# Altium project PCU.PrjPCB (part 1 of 2)
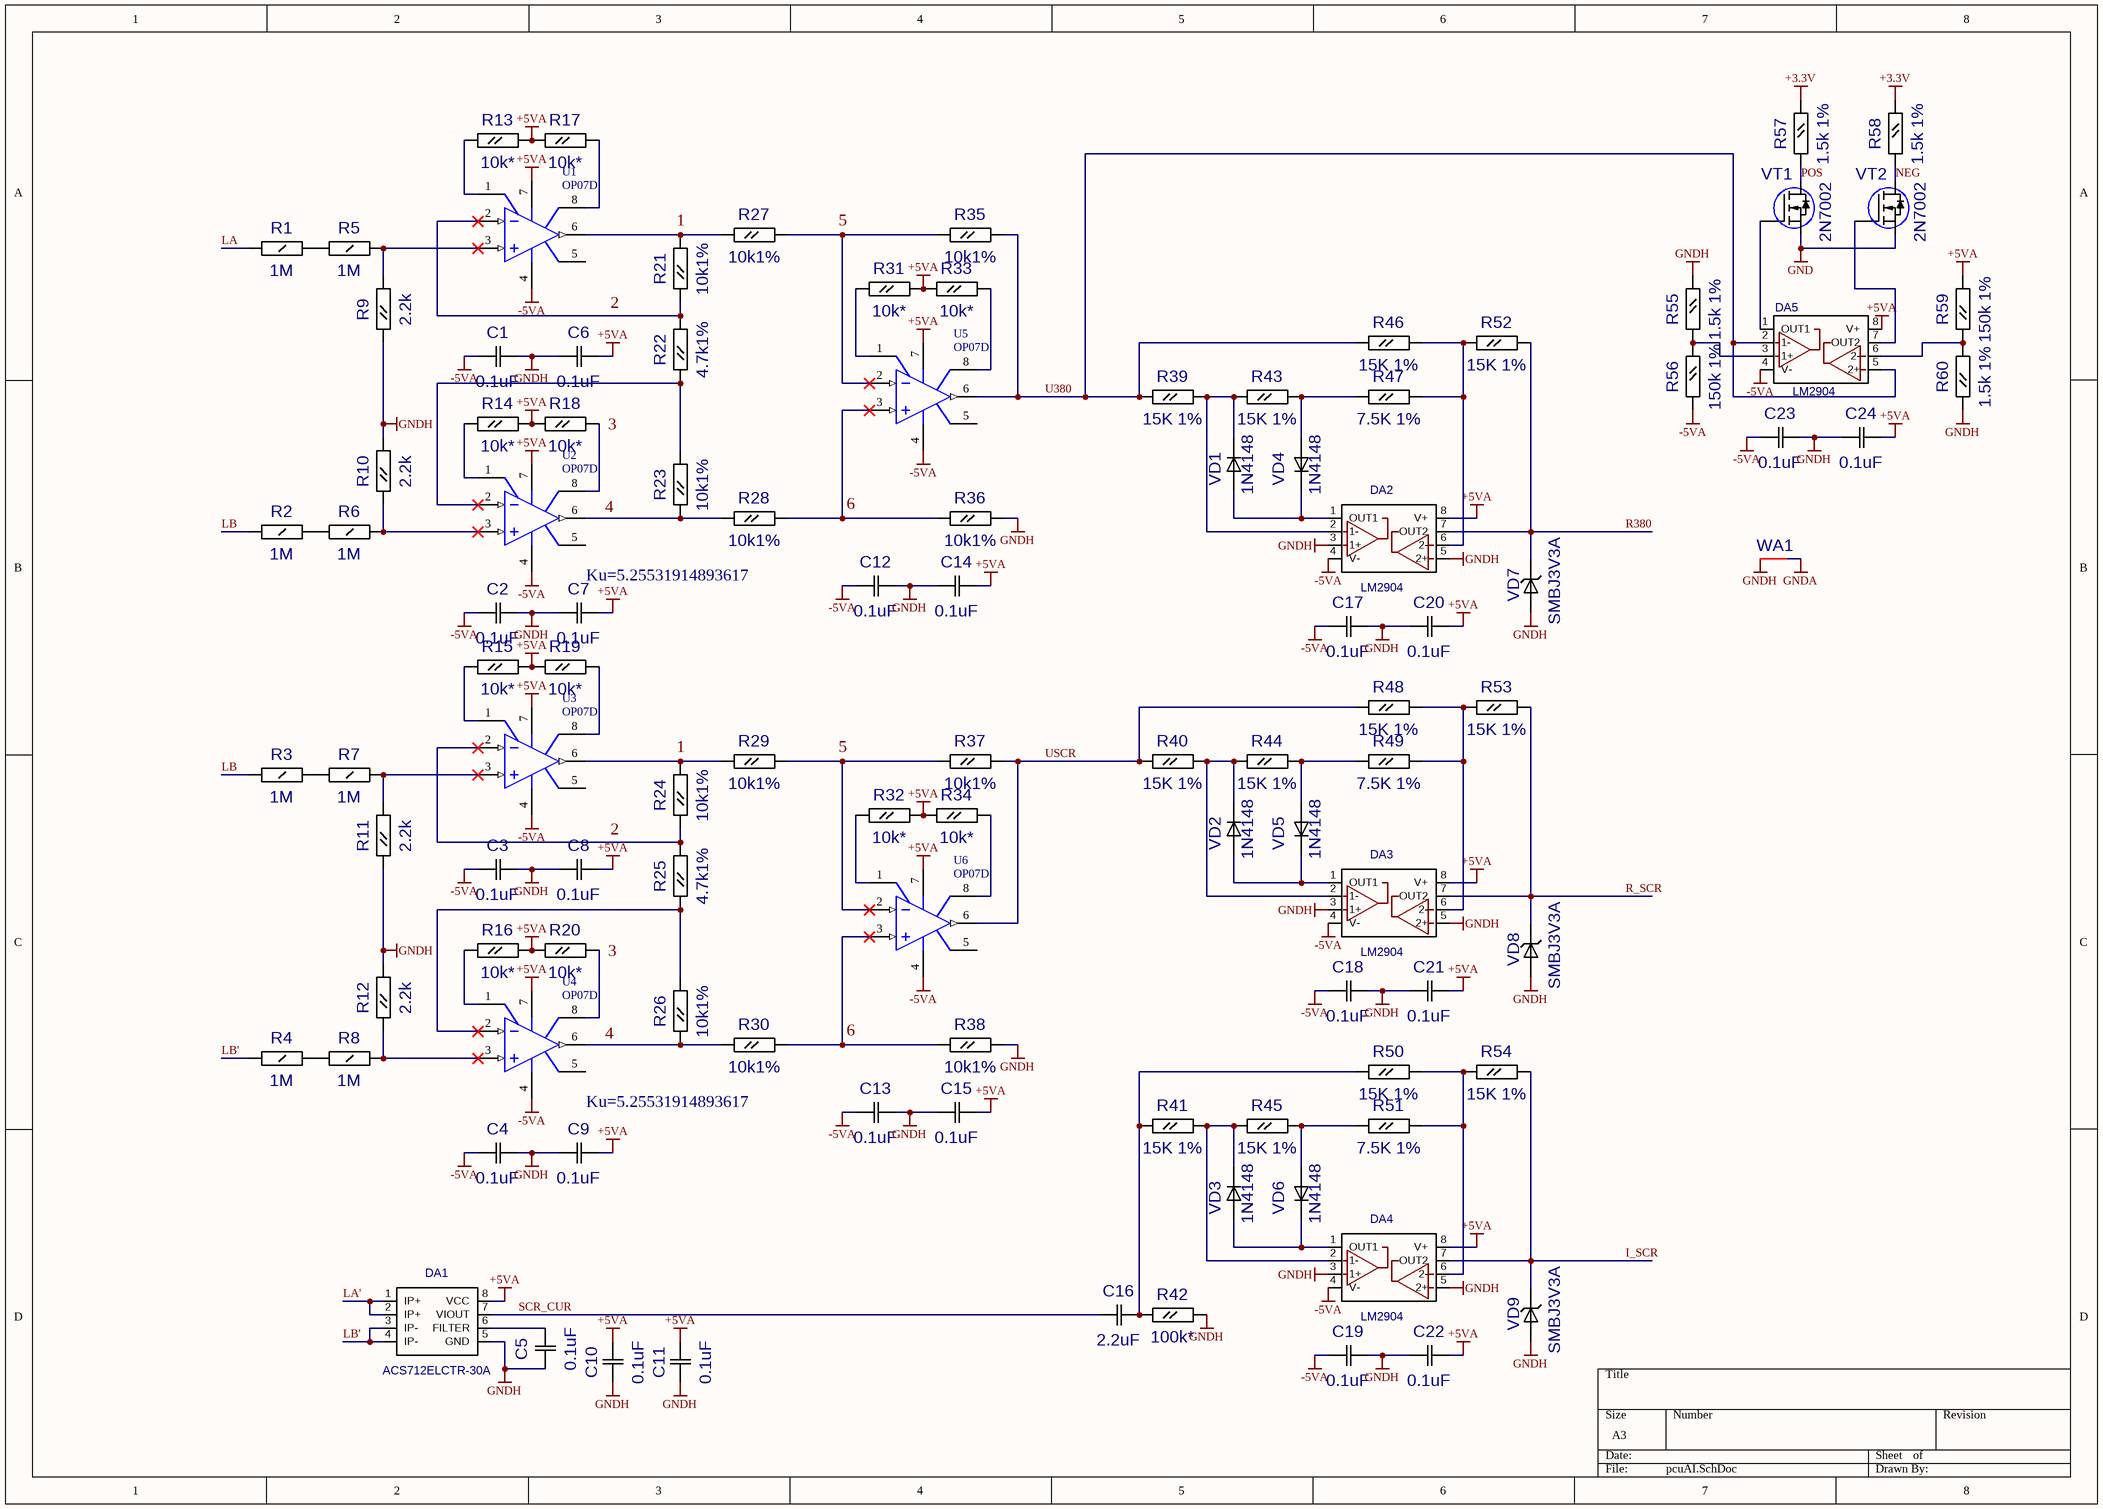
[diagram p0: pcuAI.SchDoc]
7 sheets, 611 parts. Net scope: global (net labels, ports and power ports of the same name join across sheets).
Board file: PCUv1.PcbDoc
Sheets:
  pcuAI.SchDoc
  pcuTC.SchDoc
  pcuCPU.SchDoc
  pcuPWR.SchDoc
  pcuOut.SchDoc
  pcuPL.SchDoc
  pcuETH.SchDoc

## Sheet pcuAI.SchDoc
size A3

### Parts
C1  value 0.1uF  [C0805]  (hidden comment: C0805)
C2  value 0.1uF  [C0805]  (hidden comment: C0805)
C3  value 0.1uF  [C0805]  (hidden comment: C0805)
C4  value 0.1uF  [C0805]  (hidden comment: C0805)
C5  value 0.1uF  [C0805]  (hidden comment: C0805)
C6  value 0.1uF  [C0805]  (hidden comment: C0805)
C7  value 0.1uF  [C0805]  (hidden comment: C0805)
C8  value 0.1uF  [C0805]  (hidden comment: C0805)
C9  value 0.1uF  [C0805]  (hidden comment: C0805)
C10  value 0.1uF  [C0805]  (hidden comment: C0805)
C11  value 0.1uF  [C0805]  (hidden comment: C0805)
C12  value 0.1uF  [C0805]  (hidden comment: C0805)
C13  value 0.1uF  [C0805]  (hidden comment: C0805)
C14  value 0.1uF  [C0805]  (hidden comment: C0805)
C15  value 0.1uF  [C0805]  (hidden comment: C0805)
C16  value 2.2uF  [C0805]  (hidden comment: C0805)
C17  value 0.1uF  [C0805]  (hidden comment: C0805)
C18  value 0.1uF  [C0805]  (hidden comment: C0805)
C19  value 0.1uF  [C0805]  (hidden comment: C0805)
C20  value 0.1uF  [C0805]  (hidden comment: C0805)
C21  value 0.1uF  [C0805]  (hidden comment: C0805)
C22  value 0.1uF  [C0805]  (hidden comment: C0805)
C23  value 0.1uF  [C0805]  (hidden comment: C0805)
C24  value 0.1uF  [C0805]  (hidden comment: C0805)
DA1  ACS712ELCTR-30A  [SO8-1.27]
DA2  LM2904  [SO8-1.27]
DA3  LM2904  [SO8-1.27]
DA4  LM2904  [SO8-1.27]
DA5  LM2904  [SO8-1.27]
R1  value 1M  [R1206]  (hidden comment: R1206)
R2  value 1M  [R1206]  (hidden comment: R1206)
R3  value 1M  [R1206]  (hidden comment: R1206)
R4  value 1M  [R1206]  (hidden comment: R1206)
R5  value 1M  [R1206]  (hidden comment: R1206)
R6  value 1M  [R1206]  (hidden comment: R1206)
R7  value 1M  [R1206]  (hidden comment: R1206)
R8  value 1M  [R1206]  (hidden comment: R1206)
R9  value 2.2k  [R0805]  (hidden comment: R0805)
R10  value 2.2k  [R0805]  (hidden comment: R0805)
R11  value 2.2k  [R0805]  (hidden comment: R0805)
R12  value 2.2k  [R0805]  (hidden comment: R0805)
R13  value 10k*  [R0805]  (hidden comment: R0805)
R14  value 10k*  [R0805]  (hidden comment: R0805)
R15  value 10k*  [R0805]  (hidden comment: R0805)
R16  value 10k*  [R0805]  (hidden comment: R0805)
R17  value 10k*  [R0805]  (hidden comment: R0805)
R18  value 10k*  [R0805]  (hidden comment: R0805)
R19  value 10k*  [R0805]  (hidden comment: R0805)
R20  value 10k*  [R0805]  (hidden comment: R0805)
R21  value 10k1%  [R0805]  (hidden comment: R0805)
R22  value 4.7k1%  [R0805]  (hidden comment: R0805)
R23  value 10k1%  [R0805]  (hidden comment: R0805)
R24  value 10k1%  [R0805]  (hidden comment: R0805)
R25  value 4.7k1%  [R0805]  (hidden comment: R0805)
R26  value 10k1%  [R0805]  (hidden comment: R0805)
R27  value 10k1%  [R0805]  (hidden comment: R0805)
R28  value 10k1%  [R0805]  (hidden comment: R0805)
R29  value 10k1%  [R0805]  (hidden comment: R0805)
R30  value 10k1%  [R0805]  (hidden comment: R0805)
R31  value 10k*  [R0805]  (hidden comment: R0805)
R32  value 10k*  [R0805]  (hidden comment: R0805)
R33  value 10k*  [R0805]  (hidden comment: R0805)
R34  value 10k*  [R0805]  (hidden comment: R0805)
R35  value 10k1%  [R0805]  (hidden comment: R0805)
R36  value 10k1%  [R0805]  (hidden comment: R0805)
R37  value 10k1%  [R0805]  (hidden comment: R0805)
R38  value 10k1%  [R0805]  (hidden comment: R0805)
R39  value 15K 1%  [R0805]  (hidden comment: R0805)
R40  value 15K 1%  [R0805]  (hidden comment: R0805)
R41  value 15K 1%  [R0805]  (hidden comment: R0805)
R42  value 100k*  [R0805]  (hidden comment: R0805)
R43  value 15K 1%  [R0805]  (hidden comment: R0805)
R44  value 15K 1%  [R0805]  (hidden comment: R0805)
R45  value 15K 1%  [R0805]  (hidden comment: R0805)
R46  value 15K 1%  [R0805]  (hidden comment: R0805)
R47  value 7.5K 1%  [R0805]  (hidden comment: R0805)
R48  value 15K 1%  [R0805]  (hidden comment: R0805)
R49  value 7.5K 1%  [R0805]  (hidden comment: R0805)
R50  value 15K 1%  [R0805]  (hidden comment: R0805)
R51  value 7.5K 1%  [R0805]  (hidden comment: R0805)
R52  value 15K 1%  [R0805]  (hidden comment: R0805)
R53  value 15K 1%  [R0805]  (hidden comment: R0805)
R54  value 15K 1%  [R0805]  (hidden comment: R0805)
R55  value 1.5k 1%  [R0805]  (hidden comment: R0805)
R56  value 150k 1%  [R0805]  (hidden comment: R0805)
R57  value 1.5k 1%  [R0805]  (hidden comment: R0805)
R58  value 1.5k 1%  [R0805]  (hidden comment: R0805)
R59  value 150k 1%  [R0805]  (hidden comment: R0805)
R60  value 1.5k 1%  [R0805]  (hidden comment: R0805)
U1  OP07D  [SO8-1.27]
U2  OP07D  [SO8-1.27]
U3  OP07D  [SO8-1.27]
U4  OP07D  [SO8-1.27]
U5  OP07D  [SO8-1.27]
U6  OP07D  [SO8-1.27]
VD1  value 1N4148  [SOD123]  (hidden comment: DIOD_thin)
VD2  value 1N4148  [SOD123]  (hidden comment: DIOD_thin)
VD3  value 1N4148  [SOD123]  (hidden comment: DIOD_thin)
VD4  value 1N4148  [SOD123]  (hidden comment: DIOD_thin)
VD5  value 1N4148  [SOD123]  (hidden comment: DIOD_thin)
VD6  value 1N4148  [SOD123]  (hidden comment: DIOD_thin)
VD7  value SMBJ3V3A  [DO-214AA(SMB)]  (hidden comment: 10BQ100)
VD8  value SMBJ3V3A  [DO-214AA(SMB)]  (hidden comment: 10BQ100)
VD9  value SMBJ3V3A  [DO-214AA(SMB)]  (hidden comment: 10BQ100)
VT1  2N7002  [SOT23-1]
VT2  2N7002  [SOT23-1]
WA1  Net connector  [Net connector]  (value not drawn)  (net tie, no BOM)

### Nets
+3.3V: R57.2 R58.2
+5VA: C6.2 C7.2 C8.2 C9.2 C10.2 C11.2 C14.2 C15.2 C20.2 C21.2 C22.2 C24.2 DA1.8(VCC) DA2.8(V+) DA3.8(V+) DA4.8(V+) DA5.8(V+) R13.1 R14.1 R15.1 R16.1 R17.2 R18.2 R19.2 R20.2 R31.1 R32.1 R33.2 R34.2 R59.1 U1.7(V+) U2.7(V+) U3.7(V+) U4.7(V+) U5.7(V+) U6.7(V+)
-5VA: C1.1 C2.1 C3.1 C4.1 C12.1 C13.1 C17.1 C18.1 C19.1 C23.1 DA2.4(V-) DA3.4(V-) DA4.4(V-) DA5.4(V-) R56.1 U1.4(V-) U2.4(V-) U3.4(V-) U4.4(V-) U5.4(V-) U6.4(V-)
GND: VT1.2(S) VT2.2(S)
GNDA: WA1.1
GNDH: C1.2 C2.2 C3.2 C4.2 C5.1 C6.1 C7.1 C8.1 C9.1 C10.1 C11.1 C12.2 C13.2 C14.1 C15.1 C17.2 C18.2 C19.2 C20.1 C21.1 C22.1 C23.2 C24.1 DA1.5(GND) DA2.3(1+) DA2.5(2+) DA3.3(1+) DA3.5(2+) DA4.3(1+) DA4.5(2+) R9.2 R10.1 R11.2 R12.1 R36.1 R38.1 R42.1 R55.2 R60.2 VD7.2 VD8.2 VD9.2 WA1.2
I_SCR: DA4.7(OUT2) R54.1 VD9.1
LA: R1.2
LA': DA1.1(IP+) DA1.2(IP+)
LB: R2.2 R3.2
LB': DA1.3(IP-) DA1.4(IP-) R4.2
NEG: R58.1 VT2.3(D)
POS: R57.1 VT1.3(D)
R380: DA2.7(OUT2) R52.1 VD7.1
R_SCR: DA3.7(OUT2) R53.1 VD8.1
SCR_CUR: C16.1 DA1.7(VIOUT)
U380: DA5.2(1-) DA5.5(2+) R35.1 R39.2 R46.2 U5.6(OUT)
USCR: R37.1 R40.2 R48.2 U6.6(OUT)
NetC5_2: C5.2 DA1.6(FILTER)
NetC16_2: C16.2 R41.2 R42.2 R50.2
NetDA2_1: DA2.1(OUT1) VD1.2(+) VD4.1(-)
NetDA2_2: DA2.2(1-) R39.1 R43.2 VD1.1(-)
NetDA2_6: DA2.6(2-) R46.1 R47.1 R52.2
NetDA3_1: DA3.1(OUT1) VD2.2(+) VD5.1(-)
NetDA3_2: DA3.2(1-) R40.1 R44.2 VD2.1(-)
NetDA3_6: DA3.6(2-) R48.1 R49.1 R53.2
NetDA4_1: DA4.1(OUT1) VD3.2(+) VD6.1(-)
NetDA4_2: DA4.2(1-) R41.1 R45.2 VD3.1(-)
NetDA4_6: DA4.6(2-) R50.1 R51.1 R54.2
NetDA5_1: DA5.1(OUT1) VT1.1(G)
NetDA5_3: DA5.3(1+) R55.1 R56.2
NetDA5_6: DA5.6(2-) R59.2 R60.1
NetDA5_7: DA5.7(OUT2) VT2.1(G)
NetR1_1: R1.1 R5.2
NetR2_1: R2.1 R6.2
NetR3_1: R3.1 R7.2
NetR4_1: R4.1 R8.2
NetR5_1: R5.1 R9.1 U1.3(IN+)
NetR6_1: R6.1 R10.2 U2.3(IN+)
NetR7_1: R7.1 R11.1 U3.3(IN+)
NetR8_1: R8.1 R12.2 U4.3(IN+)
NetR13_2: R13.2 U1.1(VOSTRIM)
NetR14_2: R14.2 U2.1(VOSTRIM)
NetR15_2: R15.2 U3.1(VOSTRIM)
NetR16_2: R16.2 U4.1(VOSTRIM)
NetR17_1: R17.1 U1.8(VOSTRIM)
NetR18_1: R18.1 U2.8(VOSTRIM)
NetR19_1: R19.1 U3.8(VOSTRIM)
NetR20_1: R20.1 U4.8(VOSTRIM)
NetR21_1: R21.1 R27.2 U1.6(OUT)
NetR21_2: R21.2 R22.1 U1.2(IN-)
NetR22_2: R22.2 R23.1 U2.2(IN-)
NetR23_2: R23.2 R28.2 U2.6(OUT)
NetR24_1: R24.1 R29.2 U3.6(OUT)
NetR24_2: R24.2 R25.1 U3.2(IN-)
NetR25_2: R25.2 R26.1 U4.2(IN-)
NetR26_2: R26.2 R30.2 U4.6(OUT)
NetR27_1: R27.1 R35.2 U5.2(IN-)
NetR28_1: R28.1 R36.2 U5.3(IN+)
NetR29_1: R29.1 R37.2 U6.2(IN-)
NetR30_1: R30.1 R38.2 U6.3(IN+)
NetR31_2: R31.2 U5.1(VOSTRIM)
NetR32_2: R32.2 U6.1(VOSTRIM)
NetR33_1: R33.1 U5.8(VOSTRIM)
NetR34_1: R34.1 U6.8(VOSTRIM)
NetR43_1: R43.1 R47.2 VD4.2(+)
NetR44_1: R44.1 R49.2 VD5.2(+)
NetR45_1: R45.1 R51.2 VD6.2(+)

Not connected (* = marked no-connect by the designer): U1 5(NC); U2 5(NC); U3 5(NC); U4 5(NC); U5 5(NC); U6 5(NC)

### Notes on the sheet
- (near R21) 1
- 5
- 2
- (near R18) 3
- 4
- 6
- Ku=5.25531914893617
- (near R24) 1
- (near R20) 3

### Library data of the parts
C1-C24 = C0805: RefDes2: {RefDes2}
DA1 = ACS713: Value: *
DA2-DA5 = LM2904: LM2903; Value: *
R1-R8 = R1206: RefDes2: {RefDes2}
R9-R60 = R0805: RefDes2: {RefDes2}
U1-U6 = OP07D: Ultra-Low Offset Voltage Operational Amplifier; Note: Pin 5 is not connected.; Published: 8-Jun-2000; LatestRevisionDate: 04-Mar-2005; LatestRevisionNote: Stylized 3D Model Added.; DatasheetVersion: 1992; PackageReference: N-8_A; Publisher: Altium Limited; PackageDescription: DIP; 8 Leads; Row Spacing 7.62 mm; Pitch 2.54 mm; Code_JEDEC: MO-001-AN; ComponentLink1Description: Manufacturer Link; ComponentLink1URL: http://www.analog.com/en/prod/0,,759_786_OP07%2C00.html; ComponentLink2Description: Datasheet; ComponentLink2URL: http://www.analog.com/UploadedFiles/Data_Sheets/39161232478959OP07_c.pdf
VD1-VD6 = DIOD_thin: DIOD 1N4148; RefDes2: {RefDes2}
VD7-VD9 = 10BQ100: RefDes2: {RefDes2}

## Sheet pcuTC.SchDoc
size A3
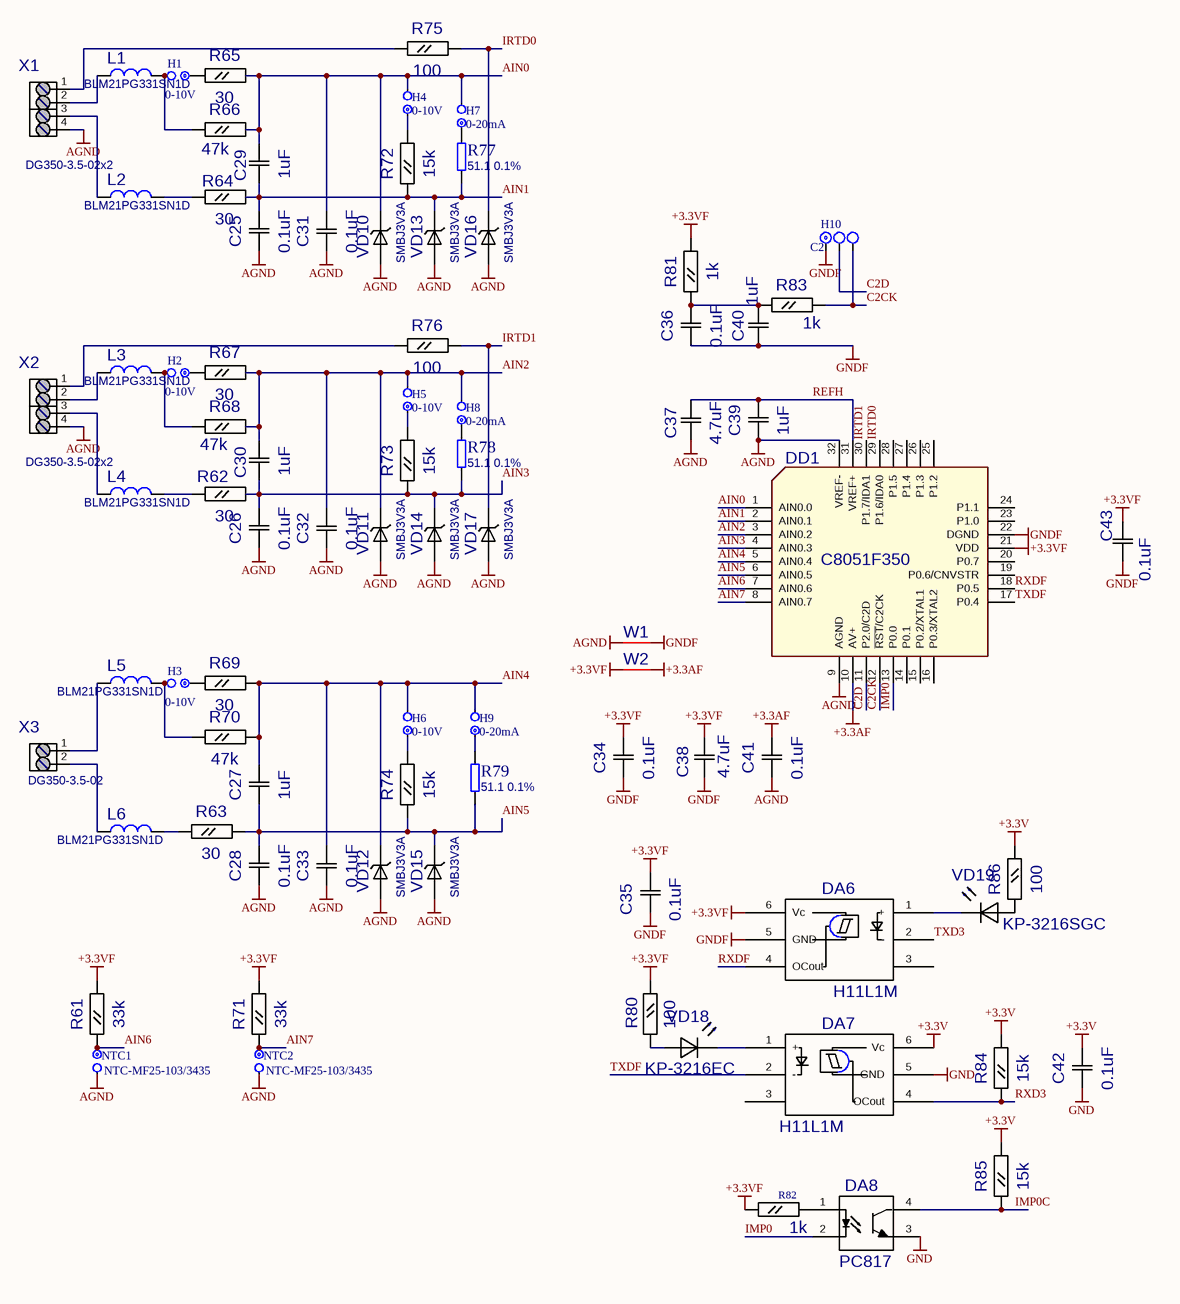
[diagram p1: pcuTC.SchDoc]

### Parts
C25  value 0.1uF  [C0805]  (hidden comment: C0805)
C26  value 0.1uF  [C0805]  (hidden comment: C0805)
C27  value 1uF  [C0805]  (hidden comment: C0805)
C28  value 0.1uF  [C0805]  (hidden comment: C0805)
C29  value 1uF  [C0805]  (hidden comment: C0805)
C30  value 1uF  [C0805]  (hidden comment: C0805)
C31  value 0.1uF  [C0805]  (hidden comment: C0805)
C32  value 0.1uF  [C0805]  (hidden comment: C0805)
C33  value 0.1uF  [C0805]  (hidden comment: C0805)
C34  value 0.1uF  [C0805]  (hidden comment: C0805)
C35  value 0.1uF  [C0805]  (hidden comment: C0805)
C36  value 0.1uF  [C0805]  (hidden comment: C0805)
C37  value 4.7uF  [C0805]  (hidden comment: C0805)
C38  value 4.7uF  [C0805]  (hidden comment: C0805)
C39  value 1uF  [C0805]  (hidden comment: C0805)
C40  value 1uF  [C0805]  (hidden comment: C0805)
C41  value 0.1uF  [C0805]  (hidden comment: C0805)
C42  value 0.1uF  [C0805]  (hidden comment: C0805)
C43  value 0.1uF  [C0805]  (hidden comment: C0805)
DA6  H11L1M  [DIP6_SURFACE]
DA7  H11L1M  [DIP6_SURFACE]
DA8  PC817  [DIL4SMD]
DD1  C8051F350  [LQFP-32_N]
H1  (no value)  [J1x2]
H2  (no value)  [J1x2]
H3  (no value)  [J1x2]
H4  (no value)  [J1x2]
H5  (no value)  [J1x2]
H6  (no value)  [J1x2]
H7  (no value)  [J1x2]
H8  (no value)  [J1x2]
H9  (no value)  [J1x2]
H10  C2  [J1x3]
L1  BLM21PG331SN1D  [R0805]
L2  BLM21PG331SN1D  [R0805]
L3  BLM21PG331SN1D  [R0805]
L4  BLM21PG331SN1D  [R0805]
L5  BLM21PG331SN1D  [R0805]
L6  BLM21PG331SN1D  [R0805]
NTC1  (no value)  [J1x2]
NTC2  (no value)  [J1x2]
R61  value 33k  [R0805]  (hidden comment: R0805)
R62  value 30  [R0805]  (hidden comment: R0805)
R63  value 30  [R0805]  (hidden comment: R0805)
R64  value 30  [R0805]  (hidden comment: R0805)
R65  value 30  [R0805]  (hidden comment: R0805)
R66  value 47k  [R0805]  (hidden comment: R0805)
R67  value 30  [R0805]  (hidden comment: R0805)
R68  value 47k  [R0805]  (hidden comment: R0805)
R69  value 30  [R0805]  (hidden comment: R0805)
R70  value 47k  [R0805]  (hidden comment: R0805)
R71  value 33k  [R0805]  (hidden comment: R0805)
R72  value 15k  [R0805]  (hidden comment: R0805)
R73  value 15k  [R0805]  (hidden comment: R0805)
R74  value 15k  [R0805]  (hidden comment: R0805)
R75  value 100  [R0805]  (hidden comment: R0805)
R76  value 100  [R0805]  (hidden comment: R0805)
R77  51.1 0.1%  [R0.25-300]
R78  51.1 0.1%  [R0.25-300]
R79  51.1 0.1%  [R0.25-300]
R80  value 100  [R0805]  (hidden comment: R0805)
R81  value 1k  [R0805]  (hidden comment: R0805)
R82  value 1k  [R0805]  (hidden comment: R0805)
R83  value 1k  [R0805]  (hidden comment: R0805)
R84  value 15k  [R0805]  (hidden comment: R0805)
R85  value 15k  [R0805]  (hidden comment: R0805)
R86  value 100  [R0805]  (hidden comment: R0805)
VD10  value SMBJ3V3A  [DO-214AA(SMB)]  (hidden comment: 10BQ100)
VD11  value SMBJ3V3A  [DO-214AA(SMB)]  (hidden comment: 10BQ100)
VD12  value SMBJ3V3A  [DO-214AA(SMB)]  (hidden comment: 10BQ100)
VD13  value SMBJ3V3A  [DO-214AA(SMB)]  (hidden comment: 10BQ100)
VD14  value SMBJ3V3A  [DO-214AA(SMB)]  (hidden comment: 10BQ100)
VD15  value SMBJ3V3A  [DO-214AA(SMB)]  (hidden comment: 10BQ100)
VD16  value SMBJ3V3A  [DO-214AA(SMB)]  (hidden comment: 10BQ100)
VD17  value SMBJ3V3A  [DO-214AA(SMB)]  (hidden comment: 10BQ100)
VD18  KP-3216EC  [KP-3216]
VD19  KP-3216SGC  [KP-3216]
W1  Net connector  [Net connector0.5mm]  (value not drawn)  (net tie, no BOM)
W2  Net connector  [Net connector0.5mm]  (value not drawn)  (net tie, no BOM)
X1  DG350-3.5-02x2  [DG350-3.5-04 SLIM - duplicate]
X2  DG350-3.5-02x2  [DG350-3.5-04 SLIM - duplicate]
X3  DG350-3.5-02  [DG350-3.5-02 SLIM]

### Nets
+3.3AF: C41.2 DD1.10(AV+) W2.1
+3.3V: C42.2 DA7.6(Vc) R84.1 R85.1 R86.2
+3.3VF: C34.2 C35.1 C38.2 C43.2 DA6.6(Vc) DD1.21(VDD) R61.1 R71.1 R80.2 R81.1 R82.2 W2.2
AGND: C25.1 C26.1 C28.1 C31.2 C32.2 C33.2 C37.2 C39.1 C41.1 DD1.9(AGND) DD1.32(VREF-) NTC1.2 NTC2.2 VD10.2 VD11.2 VD12.2 VD13.2 VD14.2 VD15.2 VD16.2 VD17.2 W1.2 X1.4 X2.4
GND: C42.1 DA7.5(GND) DA8.3(E)
GNDF: C34.1 C35.2 C36.1 C38.1 C40.1 C43.1 DA6.5(GND) DD1.22(DGND) H10.1 W1.1
AIN0: C29.2 C31.1 DD1.1(AIN0.0) H4.2 H7.2 R65.1 R66.1 VD10.1
AIN1: C25.2 C29.1 DD1.2(AIN0.1) R64.1 R72.2 R77.1 VD13.1
AIN2: C30.2 C32.1 DD1.3(AIN0.2) H5.2 H8.2 R67.1 R68.1 VD11.1
AIN3: C26.2 C30.1 DD1.4(AIN0.3) R62.1 R73.2 R78.1 VD14.1
AIN4: C27.2 C33.1 DD1.5(AIN0.4) H6.2 H9.2 R69.1 R70.1 VD12.1
AIN5: C27.1 C28.2 DD1.6(AIN0.5) R63.1 R74.2 R79.1 VD15.1
AIN6: DD1.7(AIN0.6) NTC1.1 R61.2
AIN7: DD1.8(AIN0.7) NTC2.1 R71.2
C2CK: DD1.12(~{RST}/C2CK) H10.3 R83.1
C2D: DD1.11(P2.0/C2D) H10.2
IMP0: DA8.2(-) DD1.13(P0.0)
IMP0C: DA8.4(C) R85.2
IRTD0: DD1.29(P1.6/IDA0) R75.1 VD16.1
IRTD1: DD1.30(P1.7/IDA1) R76.1 VD17.1
REFH: C37.1 C39.2 DD1.31(VREF+)
RXD3: DA7.4(OCout) R84.2
RXDF: DA6.4(OCout) DD1.18(P0.5)
TXD3: DA6.2(-)
TXDF: DA7.2(-) DD1.17(P0.4)
NetC36_2: C36.2 C40.2 R81.2 R83.2
NetDA6_1: DA6.1(+) VD19.2
NetDA7_1: DA7.1(+) VD18.2
NetDA8_1: DA8.1(+) R82.1
NetH1_1: H1.1 R65.2
NetH1_2: H1.2 L1.2 R66.2
NetH2_1: H2.1 R67.2
NetH2_2: H2.2 L3.2 R68.2
NetH3_1: H3.1 R69.2
NetH3_2: H3.2 L5.2 R70.2
NetH4_1: H4.1 R72.1
NetH5_1: H5.1 R73.1
NetH6_1: H6.1 R74.1
NetH7_1: H7.1 R77.2
NetH8_1: H8.1 R78.2
NetH9_1: H9.1 R79.2
NetL1_1: L1.1 X1.2
NetL2_1: L2.1 X1.3
NetL2_2: L2.2 R64.2
NetL3_1: L3.1 X2.2
NetL4_1: L4.1 X2.3
NetL4_2: L4.2 R62.2
NetL5_1: L5.1 X3.1
NetL6_1: L6.1 X3.2
NetL6_2: L6.2 R63.2
NetR75_2: R75.2 X1.1
NetR76_2: R76.2 X2.1
NetR80_1: R80.1 VD18.1
NetR86_1: R86.1 VD19.1

Not connected (* = marked no-connect by the designer): DA6 3; DA7 3; DD1 14(P0.1) 15(P0.2/XTAL1) 16(P0.3/XTAL2) 19(P0.6/CNVSTR) 20(P0.7) 23(P1.0) 24(P1.1) 25(P1.2) 26(P1.3) 27(P1.4) 28(P1.5)

### Notes on the sheet
- (in symbol H-1x2) 0-20mA; NTC-MF25-103/3435; 0-10V

### Library data of the parts
C25-C43 = C0805: RefDes2: {RefDes2}
DA6 DA7 = H11L1M: RefDes2: {RefDes2}
DA8 = PC817: optocuple; Value: PC817
DD1 = C8051F350: RefDes2: {RefDes2}; Value: {Value}
H1-H9 NTC1 NTC2 = H-1x2
H10 = H-1x3
L1-L6 = BLM21PG331SN1D: Ferrite beads; Value: BLM21PG331SN1D
R61-R76 R80-R86 = R0805: RefDes2: {RefDes2}
R77-R79 = R-0.25W: 0.25W 5% 250V; Price: 0.01; Value: 51.1 0.1%
VD10-VD17 = 10BQ100: RefDes2: {RefDes2}
VD18 = KP-3216EC: RefDes2: {RefDes2}
VD19 = KP-3216SGC: RefDes2: {RefDes2}
X1 X2 = DG350-3.5-04: RefDes2: {RefDes2}
X3 = DG350-3.5-02: RefDes2: {RefDes2}

## Sheet pcuCPU.SchDoc
size A3
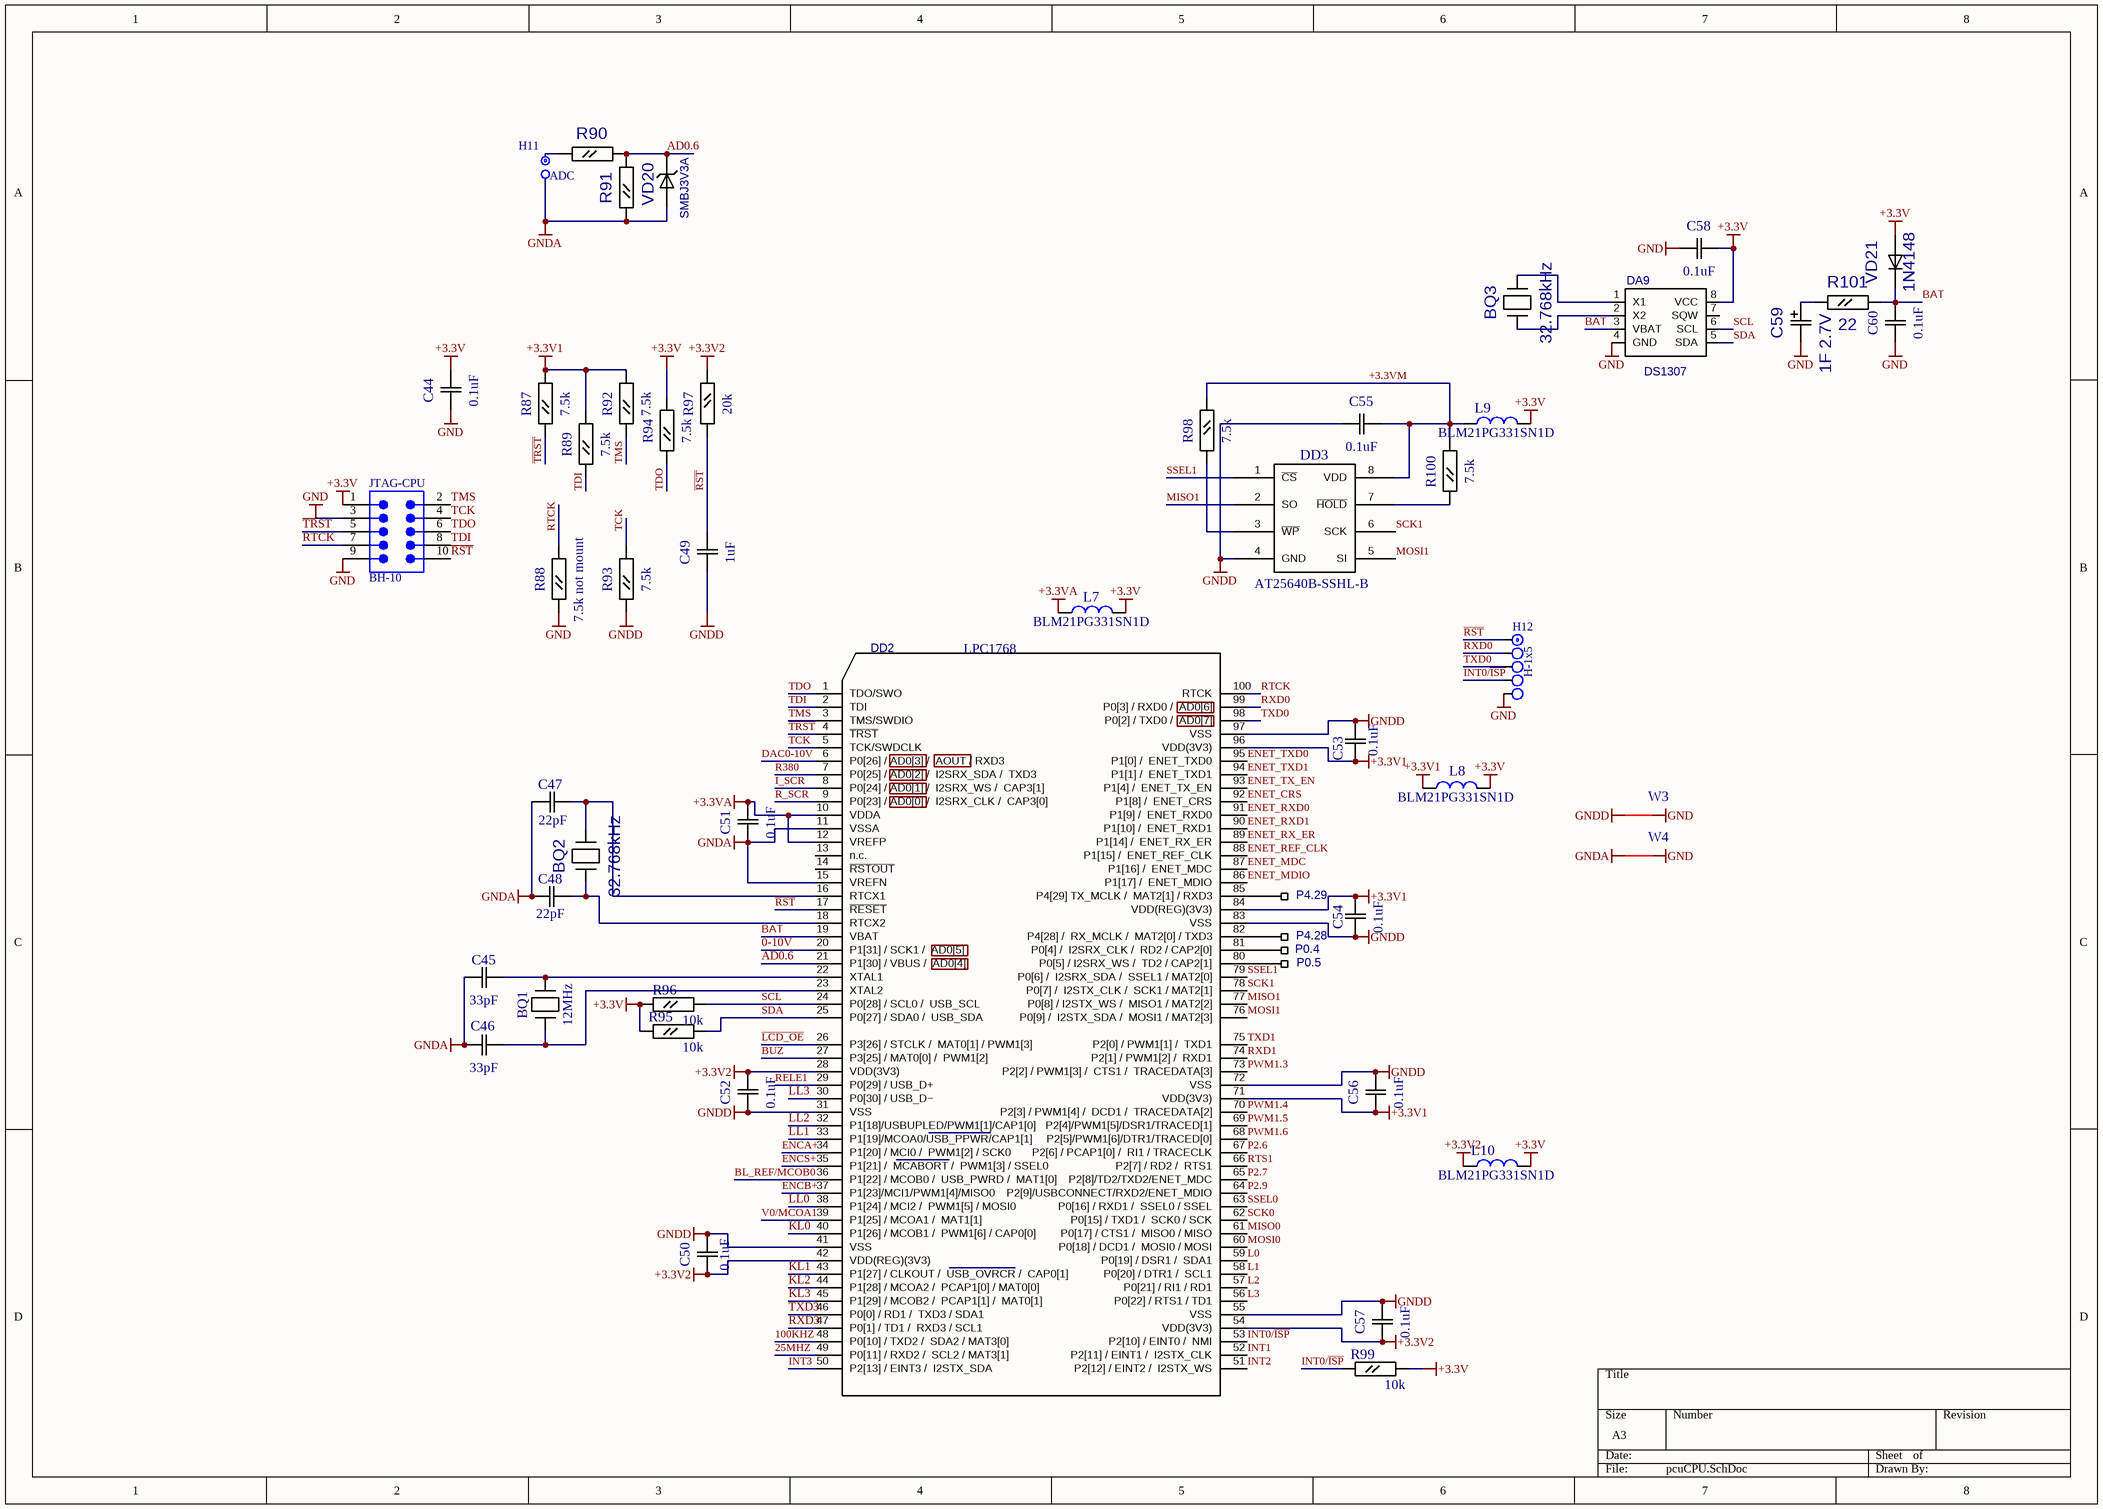
[diagram p2: pcuCPU.SchDoc]

### Parts
BQ1  value 12MHz  [HC49U]  (hidden comment: HC49_VH)
BQ2  value 32.768kHz  [R26]  (hidden comment: R26)
BQ3  value 32.768kHz  [R26smd]  (hidden comment: R26)
C44  value 0.1uF  [C0805]  (hidden comment: C0805)
C45  value 33pF  [C0805]  (hidden comment: C0805)
C46  value 33pF  [C0805]  (hidden comment: C0805)
C47  value 22pF  [C0805]  (hidden comment: C0805)
C48  value 22pF  [C0805]  (hidden comment: C0805)
C49  value 1uF  [C0805]  (hidden comment: C0805)
C50  value 0.1uF  [C0805]  (hidden comment: C0805)
C51  value 0.1uF  [C0805]  (hidden comment: C0805)
C52  value 0.1uF  [C0805]  (hidden comment: C0805)
C53  value 0.1uF  [C0805]  (hidden comment: C0805)
C54  value 0.1uF  [C0805]  (hidden comment: C0805)
C55  value 0.1uF  [C0805]  (hidden comment: C0805)
C56  value 0.1uF  [C0805]  (hidden comment: C0805)
C57  value 0.1uF  [C0805]  (hidden comment: C0805)
C58  value 0.1uF  [C0805]  (hidden comment: C0805)
C59  value 1F 2.7V  [El-d8-h12-F3.81]  (hidden comment: Cap El)
C60  value 0.1uF  [C0805]  (hidden comment: C0805)
DA9  DS1307  [SO8-1.27]
DD2  LPC1768  [QFP100-0.5MM]
DD3  value AT25640B-SSHL-B  [SO8-150]  (hidden comment: FM25L16-G)
H11  ADC  [J1x2]
H12  H-1x5  [J1x5]
JTAG-CPU  BH-10  [J2x5]
L7  BLM21PG331SN1D  [R0805]
L8  BLM21PG331SN1D  [R0805]
L9  BLM21PG331SN1D  [R0805]
L10  BLM21PG331SN1D  [R0805]
P0.4  PCB_1R  [PCB_1R_Oval]  (value not drawn)
P0.5  PCB_1R  [PCB_1R_Oval]  (value not drawn)
P4.28  PCB_1R  [PCB_1R_Oval]  (value not drawn)
P4.29  PCB_1R  [PCB_1R_Oval]  (value not drawn)
R87  value 7.5k  [R0805]  (hidden comment: R0805)
R88  value 7.5k not mount  [R0805]  (hidden comment: R0805)
R89  value 7.5k  [R0805]  (hidden comment: R0805)
R90  R0805  [R0805]  (value not drawn)
R91  R0805  [R0805]  (value not drawn)
R92  value 7.5k  [R0805]  (hidden comment: R0805)
R93  value 7.5k  [R0805]  (hidden comment: R0805)
R94  value 7.5k  [R0805]  (hidden comment: R0805)
R95  value 10k  [R0805]  (hidden comment: R0805)
R96  value 10k  [R0805]  (hidden comment: R0805)
R97  value 20k  [R0805]  (hidden comment: R0805)
R98  value 7.5k  [R0805]  (hidden comment: R0805)
R99  value 10k  [R0805]  (hidden comment: R0805)
R100  value 7.5k  [R0805]  (hidden comment: R0805)
R101  value 22  [R0805]  (hidden comment: R0805)
VD20  value SMBJ3V3A  [DO-214AA(SMB)]  (hidden comment: 10BQ100)
VD21  value 1N4148  [SOD123]  (hidden comment: DIOD_thin)
W3  Net connector  [Net connector]  (value not drawn)  (net tie, no BOM)
W4  Net connector  [Net connector0.5mm]  (value not drawn)  (net tie, no BOM)

### Nets
+3.3V: C44.2 C58.1 DA9.8(VCC) JTAG-CPU.1 L7.2 L8.2 L9.2 L10.2 R94.1 R95.2 R96.2 R99.1 VD21.2(+)
+3.3V1: C53.2 C54.2 C56.2 DD2.71(VDD(3V3)) DD2.84(VDD(REG)(3V3)) DD2.96(VDD(3V3)) L8.1 R87.1 R89.1 R92.1
+3.3V2: C50.2 C52.2 C57.2 DD2.28(VDD(3V3)) DD2.42(VDD(REG)(3V3)) DD2.54(VDD(3V3)) L10.1 R97.2
+3.3VA: C51.2 DD2.10(VDDA) DD2.12(VREFP) L7.1
GND: C44.1 C58.2 C59.2 C60.2 DA9.4(GND) H12.5 JTAG-CPU.3 JTAG-CPU.9 R88.2 W3.1 W4.1
GNDA: C45.2 C46.2 C47.1 C48.2 C51.1 DD2.11(VSSA) DD2.15(VREFN) H11.2 R91.2 VD20.2 W4.2
GNDD: C49.1 C50.1 C52.1 C53.1 C54.1 C55.2 C56.1 C57.1 DD2.31(VSS) DD2.41(VSS) DD2.55(VSS) DD2.72(VSS) DD2.83(VSS) DD2.97(VSS) DD3.4(GND) R93.2 W3.2
0-10V: DD2.20(P1[31]_/_SCK1_/__AD0[5])
25MHZ: DD2.49(P0[11]_/_RXD2_/__SCL2_/_MAT3[1])
100KHZ: DD2.48(P0[10]_/_TXD2_/__SDA2_/_MAT3[0])
+3.3VM: C55.1 DD3.8(VDD) L9.1 R98.2 R100.1
~{LCD_OE}: DD2.26(P3[26]_/_STCLK_/__MAT0[1]_/_PWM1[3])
~{TRST}: DD2.4(~{TRST}) JTAG-CPU.5 R87.2
AD0.6: DD2.21(P1[30]_/_VBUS_/__AD0[4]) R90.1 R91.1 VD20.1
BAT: C60.1 DA9.3(VBAT) DD2.19(VBAT) R101.1 VD21.1(-)
BL_REF/MCOB0: DD2.36(P1[22]_/_MCOB0_/__USB_PWRD_/__MAT1[0])
BUZ: DD2.27(P3[25]_/_MAT0[0]_/__PWM1[2])
DAC0-10V: DD2.6(P0[26]_/_AD0[3]_/__AOUT_/_RXD3)
ENCA+: DD2.34(P1[20]_/_MCI0_/__PWM1[2]_/_SCK0)
ENCB+: DD2.37(P1[23]/MCI1/PWM1[4]/MISO0)
ENCS+: DD2.35(P1[21]_/__MCABORT_/__PWM1[3]_/_SSEL0)
ENET_CRS: DD2.92(P1[8]_/__ENET_CRS)
ENET_MDC: DD2.87(P1[16]_/__ENET_MDC)
ENET_MDIO: DD2.86(P1[17]_/__ENET_MDIO)
ENET_REF_CLK: DD2.88(P1[15]_/__ENET_REF_CLK)
ENET_RX_ER: DD2.89(P1[14]_/__ENET_RX_ER)
ENET_RXD0: DD2.91(P1[9]_/__ENET_RXD0)
ENET_RXD1: DD2.90(P1[10]_/__ENET_RXD1)
ENET_TX_EN: DD2.93(P1[4]_/__ENET_TX_EN)
ENET_TXD0: DD2.95(P1[0]_/__ENET_TXD0)
ENET_TXD1: DD2.94(P1[1]_/__ENET_TXD1)
I_SCR: DD2.8(P0[24]_/_AD0[1]_/__I2SRX_WS_/__CAP3[1])
INT0/~{ISP}: DD2.53(P2[10]_/_EINT0_/__NMI) H12.4 R99.2
INT1: DD2.52(P2[11]_/_EINT1_/__I2STX_CLK)
INT2: DD2.51(P2[12]_/_EINT2_/__I2STX_WS)
INT3: DD2.50(P2[13]_/_EINT3_/__I2STX_SDA)
KL0: DD2.40(P1[26]_/_MCOB1_/__PWM1[6]_/_CAP0[0])
KL1: DD2.43(P1[27]_/_CLKOUT_/__USB_OVRCR_/__CAP0[1])
KL2: DD2.44(P1[28]_/_MCOA2_/__PCAP1[0]_/_MAT0[0])
KL3: DD2.45(P1[29]_/_MCOB2_/__PCAP1[1]_/__MAT0[1])
L0: DD2.59(P0[19]_/_DSR1_/__SDA1)
L1: DD2.58(P0[20]_/_DTR1_/__SCL1)
L2: DD2.57(P0[21]_/_RI1_/_RD1)
L3: DD2.56(P0[22]_/_RTS1_/_TD1)
LL0: DD2.38(P1[24]_/_MCI2_/__PWM1[5]_/_MOSI0)
LL1: DD2.33(P1[19]/MCOA0/USB_PPWR/CAP1[1])
LL2: DD2.32(P1[18]/USBUPLED/PWM1[1]/CAP1[0])
LL3: DD2.30(P0[30]_/_USB_D−)
MISO0: DD2.61(P0[17]_/_CTS1_/__MISO0_/_MISO)
MISO1: DD2.77(P0[8]_/_I2STX_WS_/__MISO1_/_MAT2[2]) DD3.2(SO)
MOSI0: DD2.60(P0[18]_/_DCD1_/__MOSI0_/_MOSI)
MOSI1: DD2.76(P0[9]_/__I2STX_SDA_/__MOSI1_/_MAT2[3]) DD3.5(SI)
P2.6: DD2.67(P2[6]_/_PCAP1[0]_/__RI1_/_TRACECLK)
P2.7: DD2.65(P2[8]/TD2/TXD2/ENET_MDC)
P2.9: DD2.64(P2[9]/USBCONNECT/RXD2/ENET_MDIO)
PWM1.3: DD2.73(P2[2]_/_PWM1[3]_/__CTS1_/__TRACEDATA[3])
PWM1.4: DD2.70(P2[3]_/_PWM1[4]_/__DCD1_/__TRACEDATA[2])
PWM1.5: DD2.69(P2[4]/PWM1[5]/DSR1/TRACED[1])
PWM1.6: DD2.68(P2[5]/PWM1[6]/DTR1/TRACED[0])
R380: DD2.7(P0[25]_/_AD0[2]_/__I2SRX_SDA_/__TXD3)
~{RST}: C49.2 DD2.17(~{RESET}) H12.1 JTAG-CPU.10 R97.1
R_SCR: DD2.9(P0[23]_/_AD0[0]_/__I2SRX_CLK_/__CAP3[0])
RELE1: DD2.29(P0[29]_/_USB_D+)
RTCK: DD2.100(RTCK) JTAG-CPU.7 R88.1
RTS1: DD2.66(P2[7]_/_RD2_/__RTS1)
RXD0: DD2.99(P0[3]_/_RXD0_/__AD0[6]) H12.2
RXD1: DD2.74(P2[1]_/_PWM1[2]_/__RXD1)
RXD3: DD2.47(P0[1]_/_TD1_/__RXD3_/_SCL1)
SCK0: DD2.62(P0[15]_/_TXD1_/__SCK0_/_SCK)
SCK1: DD2.78(P0[7]_/__I2STX_CLK_/__SCK1_/_MAT2[1]) DD3.6(SCK)
SCL: DA9.6(SCL) DD2.24(P0[28]_/_SCL0_/__USB_SCL) R96.1
SDA: DA9.5(SDA) DD2.25(P0[27]_/_SDA0_/__USB_SDA) R95.1
SSEL0: DD2.63(P0[16]_/_RXD1_/__SSEL0_/_SSEL)
SSEL1: DD2.79(P0[6]_/__I2SRX_SDA_/__SSEL1_/_MAT2[0]) DD3.1(~{CS})
TCK: DD2.5(TCK/SWDCLK) JTAG-CPU.4 R93.1
TDI: DD2.2(TDI) JTAG-CPU.8 R89.2
TDO: DD2.1(TDO/SWO) JTAG-CPU.6 R94.2
TMS: DD2.3(TMS/SWDIO) JTAG-CPU.2 R92.2
TXD0: DD2.98(P0[2]_/_TXD0_/__AD0[7]) H12.3
TXD1: DD2.75(P2[0]_/_PWM1[1]_/__TXD1)
TXD3: DD2.46(P0[0]_/_RD1_/__TXD3_/_SDA1)
V0/MCOA1: DD2.39(P1[25]_/_MCOA1_/__MAT1[1])
NetBQ1_1: BQ1.1 C45.1 DD2.22(XTAL1)
NetBQ1_2: BQ1.2 C46.1 DD2.23(XTAL2)
NetBQ2_1: BQ2.1 C48.1 DD2.18(RTCX2)
NetBQ2_2: BQ2.2 C47.2 DD2.16(RTCX1)
NetBQ3_1: BQ3.1 DA9.2(X2)
NetBQ3_2: BQ3.2 DA9.1(X1)
NetC59_1: C59.1 R101.2
NetDD2_80: DD2.80(P0[5]_/_I2SRX_WS_/__TD2_/_CAP2[1]) P0.5.1
NetDD2_81: DD2.81(P0[4]_/__I2SRX_CLK_/__RD2_/_CAP2[0]) P0.4.1
NetDD2_82: DD2.82(P4[28]_/__RX_MCLK_/__MAT2[0]_/_TXD3) P4.28.1
NetDD2_85: DD2.85(P4[29]_TX_MCLK_/__MAT2[1]_/_RXD3) P4.29.1
NetDD3_3: DD3.3(~{WP}) R98.1
NetDD3_7: DD3.7(~{HOLD}) R100.2
NetH11_1: H11.1 R90.2

Not connected (* = marked no-connect by the designer): DA9 7(SQW); DD2 13(n.c.) 14(~{RSTOUT})

### Library data of the parts
BQ1 = HC49_VH: RefDes2: {RefDes2}
BQ2 BQ3 = R26: RefDes2: {RefDes2}
C44-C58 C60 = C0805: RefDes2: {RefDes2}
C59 = Cap El: RefDes2: {RefDes2}
DD2 = LPC176_: Value: {Value}; RefDes2: {RefDes2}
DD3 = FM25L16-G: RefDes2: {RefDes2}
H11 = H-1x2
JTAG-CPU = BH-10: Flat Cable Connector (IDC), PCB Transition Connector, 2 Rows, Solder Pin, 10 Contacts; PCB_Layout: Complies with manufacturer's recommendation.; DrillSize: Corresponds to nominal value.; Published: 15-Nov-2004; DatasheetDocument: Sep-2003; PackageDocument: 26-Nov-2003; PackageReference: 9181109621; Publisher: Altium Limited; ComponentLink1Description: Manufacturer Link; ComponentLink1URL: http://www.harting.com/; ComponentLink2Description: Selection Guide; ComponentLink2URL: http://www.harting.com/imperia/md/content/steckverbinderundsystemkomponenten/folder/interface_engl_chapter_09.pdf
L7-L10 = BLM21PG331SN1D: Ferrite beads; Value: BLM21PG331SN1D
R87-R101 = R0805: RefDes2: {RefDes2}
VD20 = 10BQ100: RefDes2: {RefDes2}
VD21 = DIOD_thin: DIOD 1N4148; RefDes2: {RefDes2}
DA9 = DS1307: Value: *
H12 = H-1x5: Price: 0.05

## Sheet pcuPWR.SchDoc
size A3
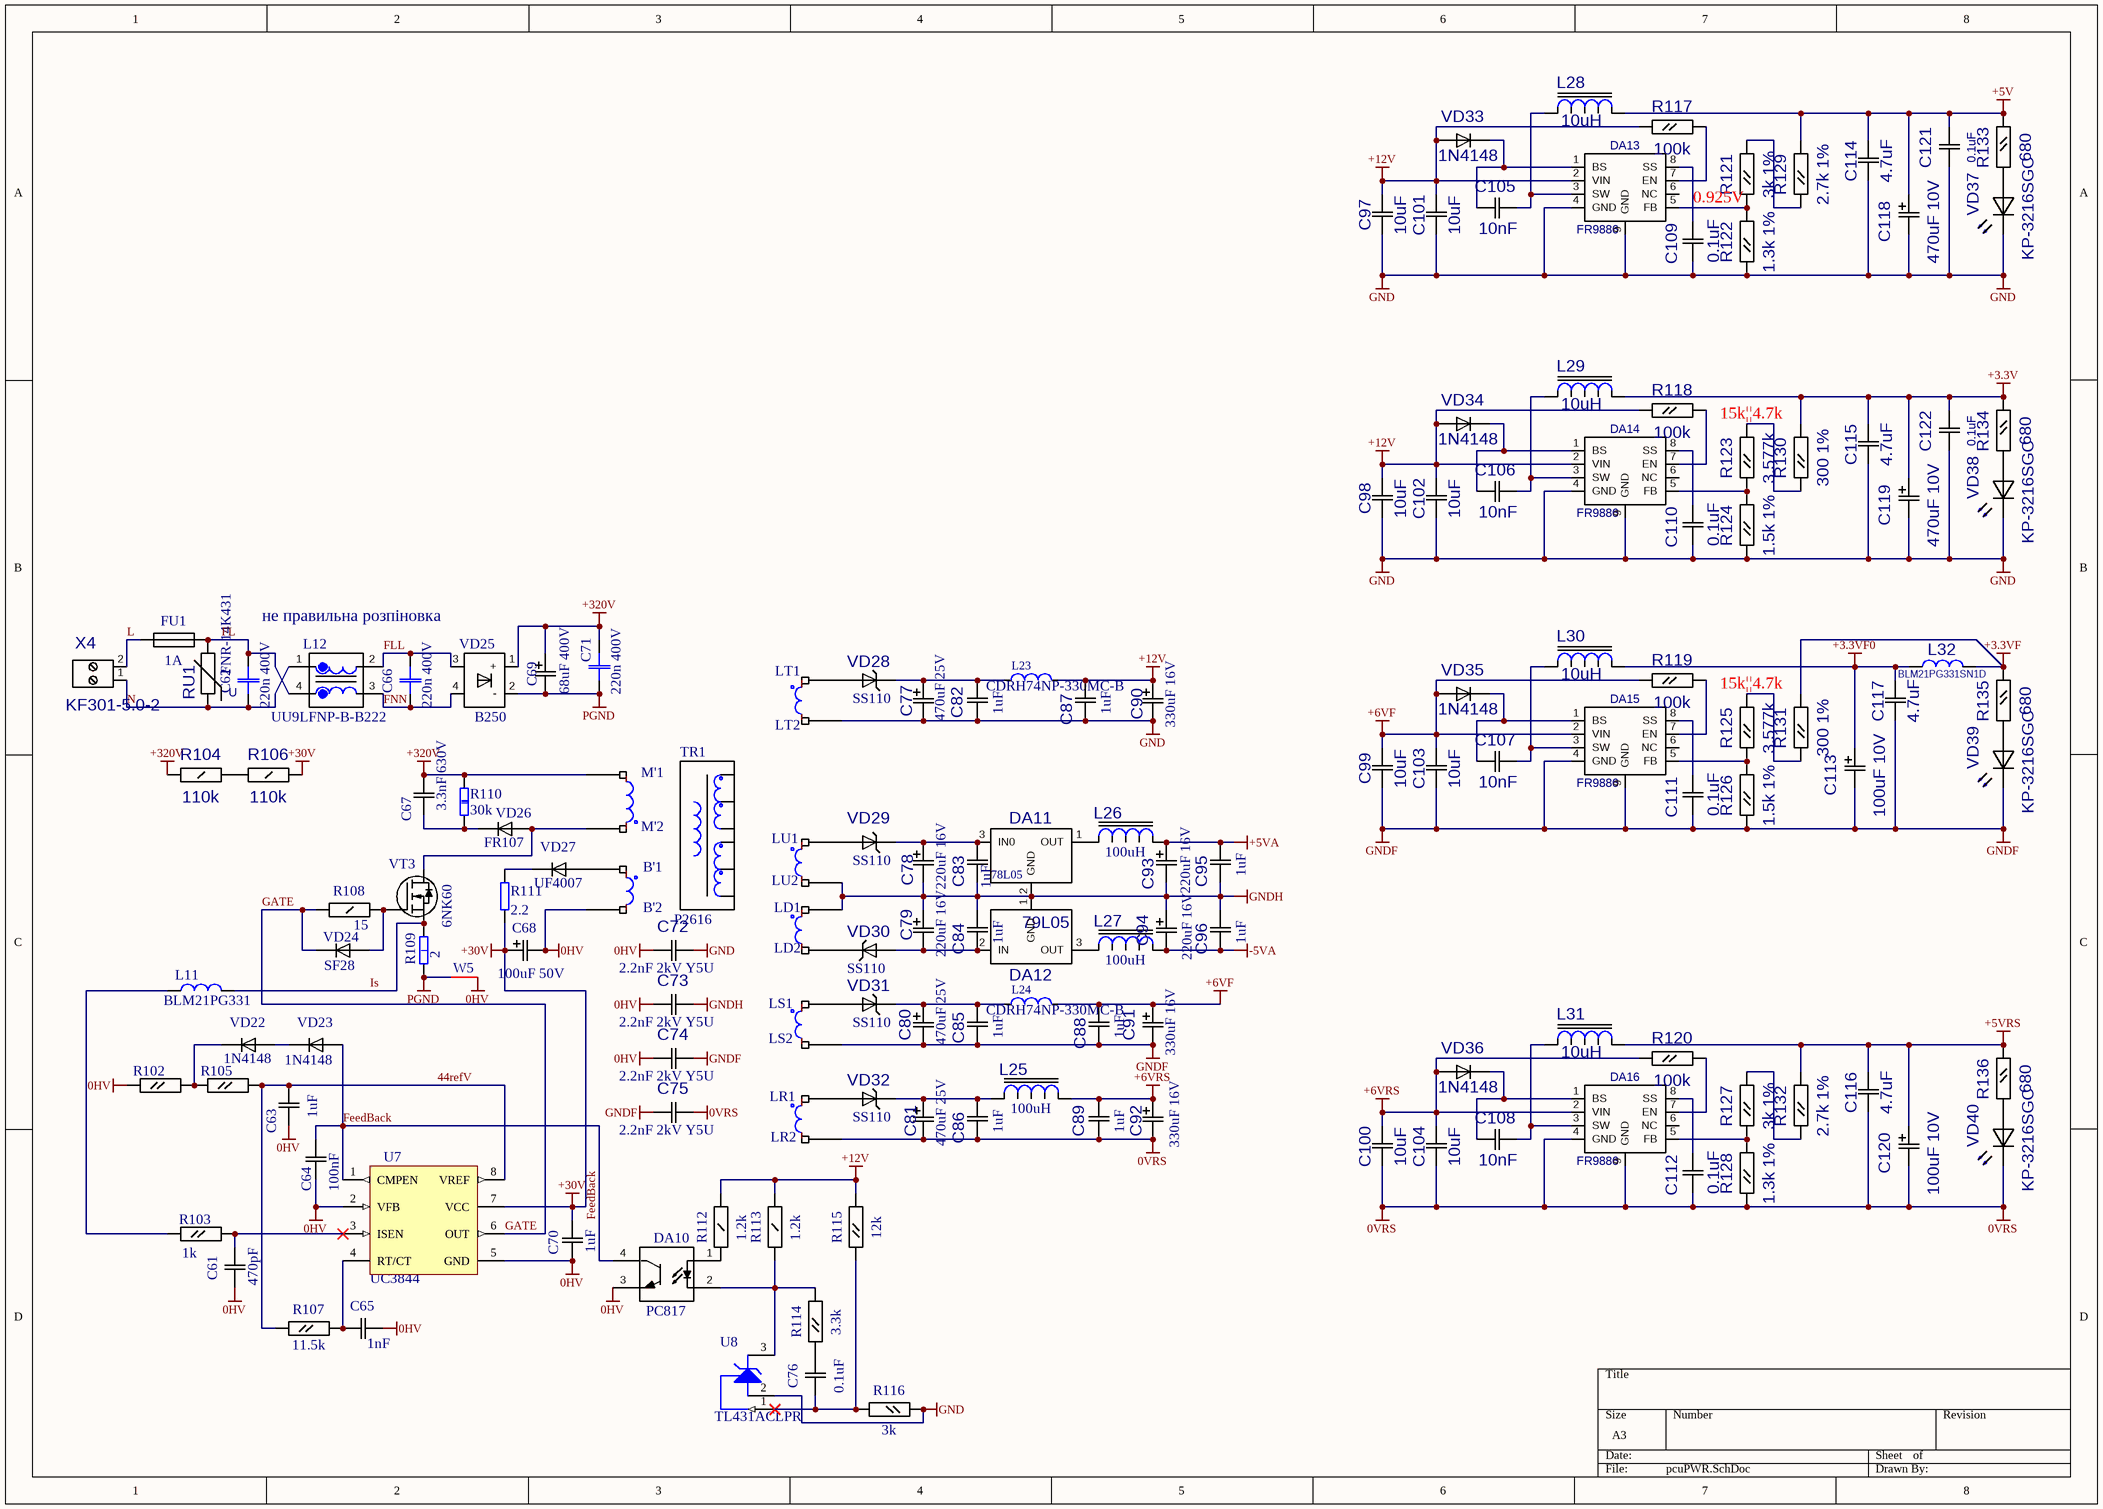
[diagram p3: pcuPWR.SchDoc]

### Parts
B'1  PCB_1R  [PCB_1R_BigOval]  (value not drawn)
B'2  PCB_1R  [PCB_1R_BigOval]  (value not drawn)
C61  value 470pF  [C0805]  (hidden comment: C0805)
C62  220n 400V  [MKP 18x7 h14 R15.24]
C63  value 1uF  [C0805]  (hidden comment: C0805)
C64  value 100nF  [C0805]  (hidden comment: C0805)
C65  value 1nF  [C0805]  (hidden comment: C0805)
C66  220n 400V  [MKP 18x7 h14 R15.24]
C67  3.3nF 630V  [Cer-Disk-d12.5-R7.62]
C68  value 100uF 50V  [El-d8-h12-F3.81]  (hidden comment: Cap El)
C69  value 68uF 400V  [El-d18-h36-F7.62]  (hidden comment: Cap El)
C70  value 1uF  [C0805]  (hidden comment: C0805)
C71  220n 400V  [MKP 18x7 h14 R15.24]
C72  2.2nF 2kV Y5U  [Cap-Disk-d8.5-R5.08]
C73  2.2nF 2kV Y5U  [Cap-Disk-d8.5-R5.08]
C74  2.2nF 2kV Y5U  [Cap-Disk-d8.5-R5.08]
C75  2.2nF 2kV Y5U  [Cap-Disk-d8.5-R5.08]
C76  value 0.1uF  [C0805]  (hidden comment: C0805)
C77  value 470uF 25V  [El-d8-h12-F3.81]  (hidden comment: Cap El)
C78  value 220uF 16V  [El-d6.3-h13-F2.54]  (hidden comment: Cap El)
C79  value 220uF 16V  [El-d6.3-h13-F2.54]  (hidden comment: Cap El)
C80  value 470uF 25V  [El-d8-h12-F3.81]  (hidden comment: Cap El)
C81  value 470uF 25V  [El-d8-h12-F3.81]  (hidden comment: Cap El)
C82  value 1uF  [C0805]  (hidden comment: C0805)
C83  value 1uF  [C0805]  (hidden comment: C0805)
C84  value 1uF  [C0805]  (hidden comment: C0805)
C85  value 1uF  [C0805]  (hidden comment: C0805)
C86  value 1uF  [C0805]  (hidden comment: C0805)
C87  value 1uF  [C0805]  (hidden comment: C0805)
C88  value 1uF  [C0805]  (hidden comment: C0805)
C89  value 1uF  [C0805]  (hidden comment: C0805)
C90  value 330uF 16V  [El-d8-h12-F3.81]  (hidden comment: Cap El)
C91  value 330uF 16V  [El-d8-h12-F3.81]  (hidden comment: Cap El)
C92  value 330uF 16V  [El-d8-h12-F3.81]  (hidden comment: Cap El)
C93  value 220uF 16V  [El-d6.3-h13-F2.54]  (hidden comment: Cap El)
C94  value 220uF 16V  [El-d6.3-h13-F2.54]  (hidden comment: Cap El)
C95  value 1uF  [C0805]  (hidden comment: C0805)
C96  value 1uF  [C0805]  (hidden comment: C0805)
C97  value 10uF  [C1206]  (hidden comment: C1206)
C98  value 10uF  [C1206]  (hidden comment: C1206)
C99  value 10uF  [C1206]  (hidden comment: C1206)
C100  value 10uF  [C1206]  (hidden comment: C1206)
C101  value 10uF  [C1206]  (hidden comment: C1206)
C102  value 10uF  [C1206]  (hidden comment: C1206)
C103  value 10uF  [C1206]  (hidden comment: C1206)
C104  value 10uF  [C1206]  (hidden comment: C1206)
C105  value 10nF  [C0805]  (hidden comment: C0805)
C106  value 10nF  [C0805]  (hidden comment: C0805)
C107  value 10nF  [C0805]  (hidden comment: C0805)
C108  value 10nF  [C0805]  (hidden comment: C0805)
C109  value 0.1uF  [C0805]  (hidden comment: C0805)
C110  value 0.1uF  [C0805]  (hidden comment: C0805)
C111  value 0.1uF  [C0805]  (hidden comment: C0805)
C112  value 0.1uF  [C0805]  (hidden comment: C0805)
C113  value 100uF 10V  [El-d5-h11-F2.54]  (hidden comment: Cap El)
C114  value 4.7uF  [C1206]  (hidden comment: C1206)
C115  value 4.7uF  [C1206]  (hidden comment: C1206)
C116  value 4.7uF  [C1206]  (hidden comment: C1206)
C117  value 4.7uF  [C1206]  (hidden comment: C1206)
C118  value 470uF 10V  [El-d8-h12-F3.81]  (hidden comment: Cap El)
C119  value 470uF 10V  [El-d8-h12-F3.81]  (hidden comment: Cap El)
C120  value 100uF 10V  [El-d5-h11-F2.54]  (hidden comment: Cap El)
C121  value 0.1uF  [C0805]  (hidden comment: C0805)
C122  value 0.1uF  [C0805]  (hidden comment: C0805)
DA10  PC817  [DIL4-300a]
DA11  78L05  [TO-92 - 1-2-3]
DA12  79L05  [TO-92 - 1-2-3]
DA13  FR9886  [SO8TP]
DA14  FR9886  [SO8TP]
DA15  FR9886  [SO8TP]
DA16  FR9886  [SO8TP]
FU1  value 1A  [FU_5x15]  (hidden comment: FUSE-D5)
L11  BLM21PG331  [R0805]
L12  UU9LFNP-B-B222  [UU9LF]
L23  CDRH74NP-330MC-B  [Dr-DRH-74]
L24  CDRH74NP-330MC-B  [Dr-DRH-74]
L25  100uH  [CD54]
L26  100uH  [CD54]
L27  100uH  [CD54]
L28  10uH  [CD32]
L29  10uH  [CD32]
L30  10uH  [CD32]
L31  10uH  [CD32]
L32  BLM21PG331SN1D  [R0805]
LD1  PCB_1R  [PCB_1R_BigOval]  (value not drawn)
LD2  PCB_1R  [PCB_1R_BigOval]  (value not drawn)
LR1  PCB_1R  [PCB_1R_BigOval]  (value not drawn)
LR2  PCB_1R  [PCB_1R_BigOval]  (value not drawn)
LS1  PCB_1R  [PCB_1R_BigOval]  (value not drawn)
LS2  PCB_1R  [PCB_1R_BigOval]  (value not drawn)
LT1  PCB_1R  [PCB_1R_BigOval]  (value not drawn)
LT2  PCB_1R  [PCB_1R_BigOval]  (value not drawn)
LU1  PCB_1R  [PCB_1R_BigOval]  (value not drawn)
LU2  PCB_1R  [PCB_1R_BigOval]  (value not drawn)
M'1  PCB_1R  [PCB_1R_BigOval]  (value not drawn)
M'2  PCB_1R  [PCB_1R_BigOval]  (value not drawn)
R102  R0805  [R0805]  (value not drawn)
R103  value 1k  [R0805]  (hidden comment: R0805)
R104  value 110k  [R1206]  (hidden comment: R1206)
R105  R0805  [R0805]  (value not drawn)
R106  value 110k  [R1206]  (hidden comment: R1206)
R107  value 11.5k  [R0805]  (hidden comment: R0805)
R108  value 15  [R1206]  (hidden comment: R1206)
R109  2  [R1W CF-500]
R110  30k  [R3W MO-700]
R111  2.2  [R0.25-300]
R112  value 1.2k  [R1206]  (hidden comment: R1206)
R113  value 1.2k  [R1206]  (hidden comment: R1206)
R114  value 3.3k  [R0805]  (hidden comment: R0805)
R115  value 12k  [R0805]  (hidden comment: R0805)
R116  value 3k  [R0805]  (hidden comment: R0805)
R117  value 100k  [R0805]  (hidden comment: R0805)
R118  value 100k  [R0805]  (hidden comment: R0805)
R119  value 100k  [R0805]  (hidden comment: R0805)
R120  value 100k  [R0805]  (hidden comment: R0805)
R121  value 3k 1%  [R0805]  (hidden comment: R0805)
R122  value 1.3k 1%  [R0805]  (hidden comment: R0805)
R123  value 3.577k  [R0805]  (hidden comment: R0805)
R124  value 1.5k 1%  [R0805]  (hidden comment: R0805)
R125  value 3.577k  [R0805]  (hidden comment: R0805)
R126  value 1.5k 1%  [R0805]  (hidden comment: R0805)
R127  value 3k 1%  [R0805]  (hidden comment: R0805)
R128  value 1.3k 1%  [R0805]  (hidden comment: R0805)
R129  value 2.7k 1%  [R0805]  (hidden comment: R0805)
R130  value 300 1%  [R0805]  (hidden comment: R0805)
R131  value 300 1%  [R0805]  (hidden comment: R0805)
R132  value 2.7k 1%  [R0805]  (hidden comment: R0805)
R133  value 680  [R0805]  (hidden comment: R0805)
R134  value 680  [R0805]  (hidden comment: R0805)
R135  value 680  [R0805]  (hidden comment: R0805)
R136  value 680  [R0805]  (hidden comment: R0805)
RU1  value FNR-14K431  [VAR_D15_t5]  (hidden comment: VAR593)
TR1  P2616  [P2616]
U7  UC3844  [SO8-1.27]
U8  TL431ACLPR  [TI-LP3]
VD22  value 1N4148  [SOD123]  (hidden comment: DIOD_thin)
VD23  value 1N4148  [SOD123]  (hidden comment: DIOD_thin)
VD24  value SF28  [DIOD_small_bigholes]  (hidden comment: DIOD)
VD25  B250  [CS30D]
VD26  value FR107  [DIOD_small_bigholes]  (hidden comment: DIOD)
VD27  value UF4007  [DIOD_small_bigholes]  (hidden comment: DIOD)
VD28  value SS110  [DO-214AC(SMA)]  (hidden comment: 10BQ100)
VD29  value SS110  [DO-214AC(SMA)]  (hidden comment: 10BQ100)
VD30  value SS110  [DO-214AC(SMA)]  (hidden comment: 10BQ100)
VD31  value SS110  [DO-214AC(SMA)]  (hidden comment: 10BQ100)
VD32  value SS110  [DO-214AC(SMA)]  (hidden comment: 10BQ100)
VD33  value 1N4148  [SOD123]  (hidden comment: DIOD_thin)
VD34  value 1N4148  [SOD123]  (hidden comment: DIOD_thin)
VD35  value 1N4148  [SOD123]  (hidden comment: DIOD_thin)
VD36  value 1N4148  [SOD123]  (hidden comment: DIOD_thin)
VD37  KP-3216SGC  [KP-3216]
VD38  KP-3216SGC  [KP-3216]
VD39  KP-3216SGC  [KP-3216]
VD40  KP-3216SGC  [KP-3216]
VT3  value 6NK60  [TO220-RB-600]  (hidden comment: IRF620)
W5  Net connector  [Net connector0.5mm]  (value not drawn)  (net tie, no BOM)
X4  KF301-5.0-2  [KF301-5.0-2]

### Nets
0HV: B'2.1 C61.1 C63.1 C64.1 C65.2 C68.2 C70.1 C72.1 C73.1 C74.1 DA10.3(E) R102.2 U7.2(VFB) U7.5(GND) W5.1
0VRS: C75.2 C81.2 C86.1 C89.1 C92.2 C100.1 C104.1 C112.1 C116.1 C120.2 DA16.4(GND) DA16.9(GND) LR2.1 R128.2 VD40.2
+3.3V: C115.2 C119.1 C122.2 L29.2 R130.1 R134.2
+3.3VF: L32.2 R131.1 R135.2
+3.3VF0: C113.1 C117.2 L30.2 L32.1
+5V: C114.2 C118.1 C121.2 L28.2 R129.1 R133.2
+5VA: C93.1 C95.2 L26.2
+5VRS: C116.2 C120.1 L31.2 R132.1 R136.2
+6VF: C88.2 C91.1 C99.2 C103.2 DA15.2(VIN) L24.2 R119.2 VD35.2(+)
+6VRS: C89.2 C92.1 C100.2 C104.2 DA16.2(VIN) L25.2 R120.2 VD36.2(+)
+12V: C87.2 C90.1 C97.2 C98.2 C101.2 C102.2 DA13.2(VIN) DA14.2(VIN) L23.2 R112.1 R113.1 R115.1 R117.2 R118.2 VD33.2(+) VD34.2(+)
+30V: C68.1 C70.2 R106.1 R111.1 U7.7(VCC)
+320V: C67.1 C69.1 C71.1 M'1.1 R104.2 R110.2 VD25.1(+)
-5VA: C94.2 C96.1 L27.2
GND: C72.2 C77.2 C82.1 C87.1 C90.2 C97.1 C98.1 C101.1 C102.1 C109.1 C110.1 C114.1 C115.1 C118.2 C119.2 C121.1 C122.1 DA13.4(GND) DA13.9(GND) DA14.4(GND) DA14.9(GND) LT2.1 R116.2 R122.2 R124.2 U8.2(ANODE) VD37.2 VD38.2
GNDF: C74.2 C75.1 C80.2 C85.1 C88.1 C91.2 C99.1 C103.1 C111.1 C113.2 C117.1 DA15.4(GND) DA15.9(GND) LS2.1 R126.2 VD39.2
GNDH: C73.2 C78.2 C79.1 C83.1 C84.2 C93.2 C94.1 C95.1 C96.2 DA11.2(GND) DA12.1(GND) LD1.1 LU2.1
PGND: C69.2 C71.2 R109.1 VD25.2(-) W5.2
44refV: C63.2 R105.1 R107.2 U7.8(VREF)
FeedBack: C64.2 DA10.4(C) U7.1(CMPEN) VD23.2(+)
FL: C62.1 FU1.2 L12.4 RU1.1
FLL: C66.1 L12.2 VD25.3
FNN: C66.2 L12.3 VD25.4
GATE: R108.2 U7.6(OUT) VD24.1(-)
Is: L11.2 R109.2 VT3.3(S)
L: FU1.1 X4.2
N: C62.2 L12.1 RU1.2 X4.1
NetB'1_1: B'1.1 VD27.2(+)
NetC61_2: C61.2 R103.1 U7.3(ISEN)
NetC65_1: C65.1 R107.1 U7.4(RT/CT)
NetC67_2: C67.2 R110.1 VD26.1(-)
NetC76_1: C76.1 R115.2 R116.1 U8.1(REF)
NetC76_2: C76.2 R114.2
NetC77_1: C77.1 C82.2 L23.1 VD28.1
NetC78_1: C78.1 C83.2 DA11.3(IN0) VD29.1
NetC79_2: C79.2 C84.1 DA12.2(IN) VD30.2
NetC80_1: C80.1 C85.2 L24.1 VD31.1
NetC81_1: C81.1 C86.2 L25.1 VD32.1
NetC105_1: C105.1 DA13.1(BS) VD33.1(-)
NetC105_2: C105.2 DA13.3(SW) L28.1
NetC106_1: C106.1 DA14.1(BS) VD34.1(-)
NetC106_2: C106.2 DA14.3(SW) L29.1
NetC107_1: C107.1 DA15.1(BS) VD35.1(-)
NetC107_2: C107.2 DA15.3(SW) L30.1
NetC108_1: C108.1 DA16.1(BS) VD36.1(-)
NetC108_2: C108.2 DA16.3(SW) L31.1
NetC109_2: C109.2 DA13.8(SS)
NetC110_2: C110.2 DA14.8(SS)
NetC111_2: C111.2 DA15.8(SS)
NetC112_2: C112.2 DA16.8(SS)
NetDA10_1: DA10.1(+) R112.2
NetDA10_2: DA10.2(-) R113.2 R114.1 U8.3(CATHODE)
NetDA11_1: DA11.1(OUT) L26.1
NetDA12_3: DA12.3(OUT) L27.1
NetDA13_5: DA13.5(FB) R121.2 R122.1
NetDA13_7: DA13.7(EN) R117.1
NetDA14_5: DA14.5(FB) R123.2 R124.1
NetDA14_7: DA14.7(EN) R118.1
NetDA15_5: DA15.5(FB) R125.2 R126.1
NetDA15_7: DA15.7(EN) R119.1
NetDA16_5: DA16.5(FB) R127.2 R128.1
NetDA16_7: DA16.7(EN) R120.1
NetL11_1: L11.1 R103.2
NetLD2_1: LD2.1 VD30.1
NetLR1_1: LR1.1 VD32.2
NetLS1_1: LS1.1 VD31.2
NetLT1_1: LT1.1 VD28.2
NetLU1_1: LU1.1 VD29.2
NetM'2_1: M'2.1 VD26.2(+) VT3.2(D)
NetR102_1: R102.1 R105.2 VD22.1(-)
NetR104_1: R104.1 R106.2
NetR108_1: R108.1 VD24.2(+) VT3.1(G)
NetR111_2: R111.2 VD27.1(-)
NetR121_1: R121.1 R129.2
NetR123_1: R123.1 R130.2
NetR125_1: R125.1 R131.2
NetR127_1: R127.1 R132.2
NetR133_1: R133.1 VD37.1
NetR134_1: R134.1 VD38.1
NetR135_1: R135.1 VD39.1
NetR136_1: R136.1 VD40.1
NetVD22_2: VD22.2(+) VD23.1(-)

Not connected (* = marked no-connect by the designer): DA13 6(NC); DA14 6(NC); DA15 6(NC); DA16 6(NC)

### Notes on the sheet
- (near R121) 0.925V
- 15k||4.7k
- не правильна розпіновка
- (in symbol VARISTOR_D15) U

### Library data of the parts
C61 C63-C65 C70 C76 C82-C89 C95 C96 C121 C122 = C0805: RefDes2: {RefDes2}
C62 C66 C71 = MKS4 220n 400V: Value: 220n 400V
C67 C72-C75 = Cap: CBB21; RefDes2: {RefDes2}
C68 C69 C77-C81 C90-C94 C113 C118-C120 = Cap El: RefDes2: {RefDes2}
C97-C104 C114-C117 = C1206: RefDes2: {RefDes2}
DA10 = PC817: optocuple; Value: PC817
DA11 = MC78LXX: RefDes2: {RefDes2}; Value: {Value}
DA12 = 79L05: RefDes2: {RefDes2}; Value: {Value}
DA13-DA16 = FR9886: 23V, 2A, 380KHz Synchronous Step-Down  DC/DC Converter; Value: {Value}
FU1 = FUSE-D5: Fuse; RefDes2: {RefDes2}
L11 L32 = BLM21PG331SN1D: Ferrite beads
  L11: Value: BLM21PG331
  L32: Value: BLM21PG331SN1D
L12 = UU9LF: AC COMMON MODE COIL; Value: *
L23 L24 = L-DRH-74 33uH: 1.05A 0.17ohm; Value: CDRH74NP-330MC-B
L25-L27 = CD54: SMD Power Inductor  L×W×H: 6.1×5.5×4.85mm Max.; RefDes2: {RefDes2}; Value: 100uH
L28-L31 = CD32: SMD Power Inductor LxWxH: 3.5x3.1x2.5mm Max; RefDes2: {RefDes2}; Value: 10uH
R102 R103 R105 R107 R114-R116 R121-R136 = R0805: RefDes2: {RefDes2}
R104 R106 R108 R112 R113 = R1206: RefDes2: {RefDes2}
R109 = R-1W CF: 1W 5% 500V; Price: 0.053; Value: 2
R110 = R-3W MO: 3W 5% 500V; Value: 30k
R111 = R-0.25W: 0.25W 5% 250V; Value: 2.2
RU1 = VARISTOR_D15: RefDes2: {RefDes2}
TR1 = P2616: transformer
U7 = UC3844: Current-Mode PWM Controller
U8 = TL431ACLPR: Adjustable Precision Shunt Regulator, 34 ppm / degC, 100 mA, 0 to 70 degC, 3-pin TO-92 (LP), Pb-Free (RoHS); Manufacturer: Texas Instruments; Initial Accuracy @ 25/deg C(%): 1; Iout/Iz(Max)(mA): 100; Min Iz for Regulation(uA): 600; Rating: Catalog; SubFamily: Shunt Voltage Reference; Temp Coeff(Max)(ppm/ degree C): 92; Temp Coeff(Typ)(ppm/ degree C): 34; VO Adj(Max)(V): 36; VO Adj(Min)(V): 2.495; DatasheetVersion: SLVS543M; PackageVersion: 4040001-2/C; PackageReference: LP3; PackageDescription: Plastic Cylindrical Package, Formed Lead Option (TO-92); Supplier 1: Digi-Key; Supplier Part Number 1: 296-1287-2-ND; Supplier 2: Digi-Key; Supplier Part Number 2: 296-1287-1-ND; Supplier 3: Digi-Key; Supplier Part Number 3: 296-1287-6-ND; Supplier 4: Newark; Supplier Part Number 4: 35C2183; Supplier 5: Mouser; Supplier Part Number 5: 595-TL431ACLPR; Eco-Plan: Pb-Free (RoHS); Mounting Technology: Through Hole; Code_JEDEC: TO-226; PartNumber: TL431ACLPR; ComponentLink1Description: Manufacturer URL; ComponentLink1URL: http://www.ti.com/; ComponentLink2Description: Datasheet; ComponentLink2URL: http://www.ti.com/general/docs/lit/getliterature.tsp?genericPartNumber=TL431A&fileType=pdf; ComponentLink3Description: Package Specification; ComponentLink3URL: http://www.ti.com/litv/pdf/msot002a
VD22 VD23 VD33-VD36 = DIOD_thin: DIOD 1N4148; RefDes2: {RefDes2}
VD24 VD26 VD27 = DIOD: RefDes2: {RefDes2}
VD25 = B250: RefDes2: {RefDes2}; Value: *
VD28-VD32 = 10BQ100: RefDes2: {RefDes2}
VD37-VD40 = KP-3216SGC: RefDes2: {RefDes2}
VT3 = MOSFET_N: N-Channel MOSFET
X4 = KF301-5.0-2: 5mm 2pins; RefDes2: {RefDes2}